# EAGLE design B115X (EAGLE 6.6.0)
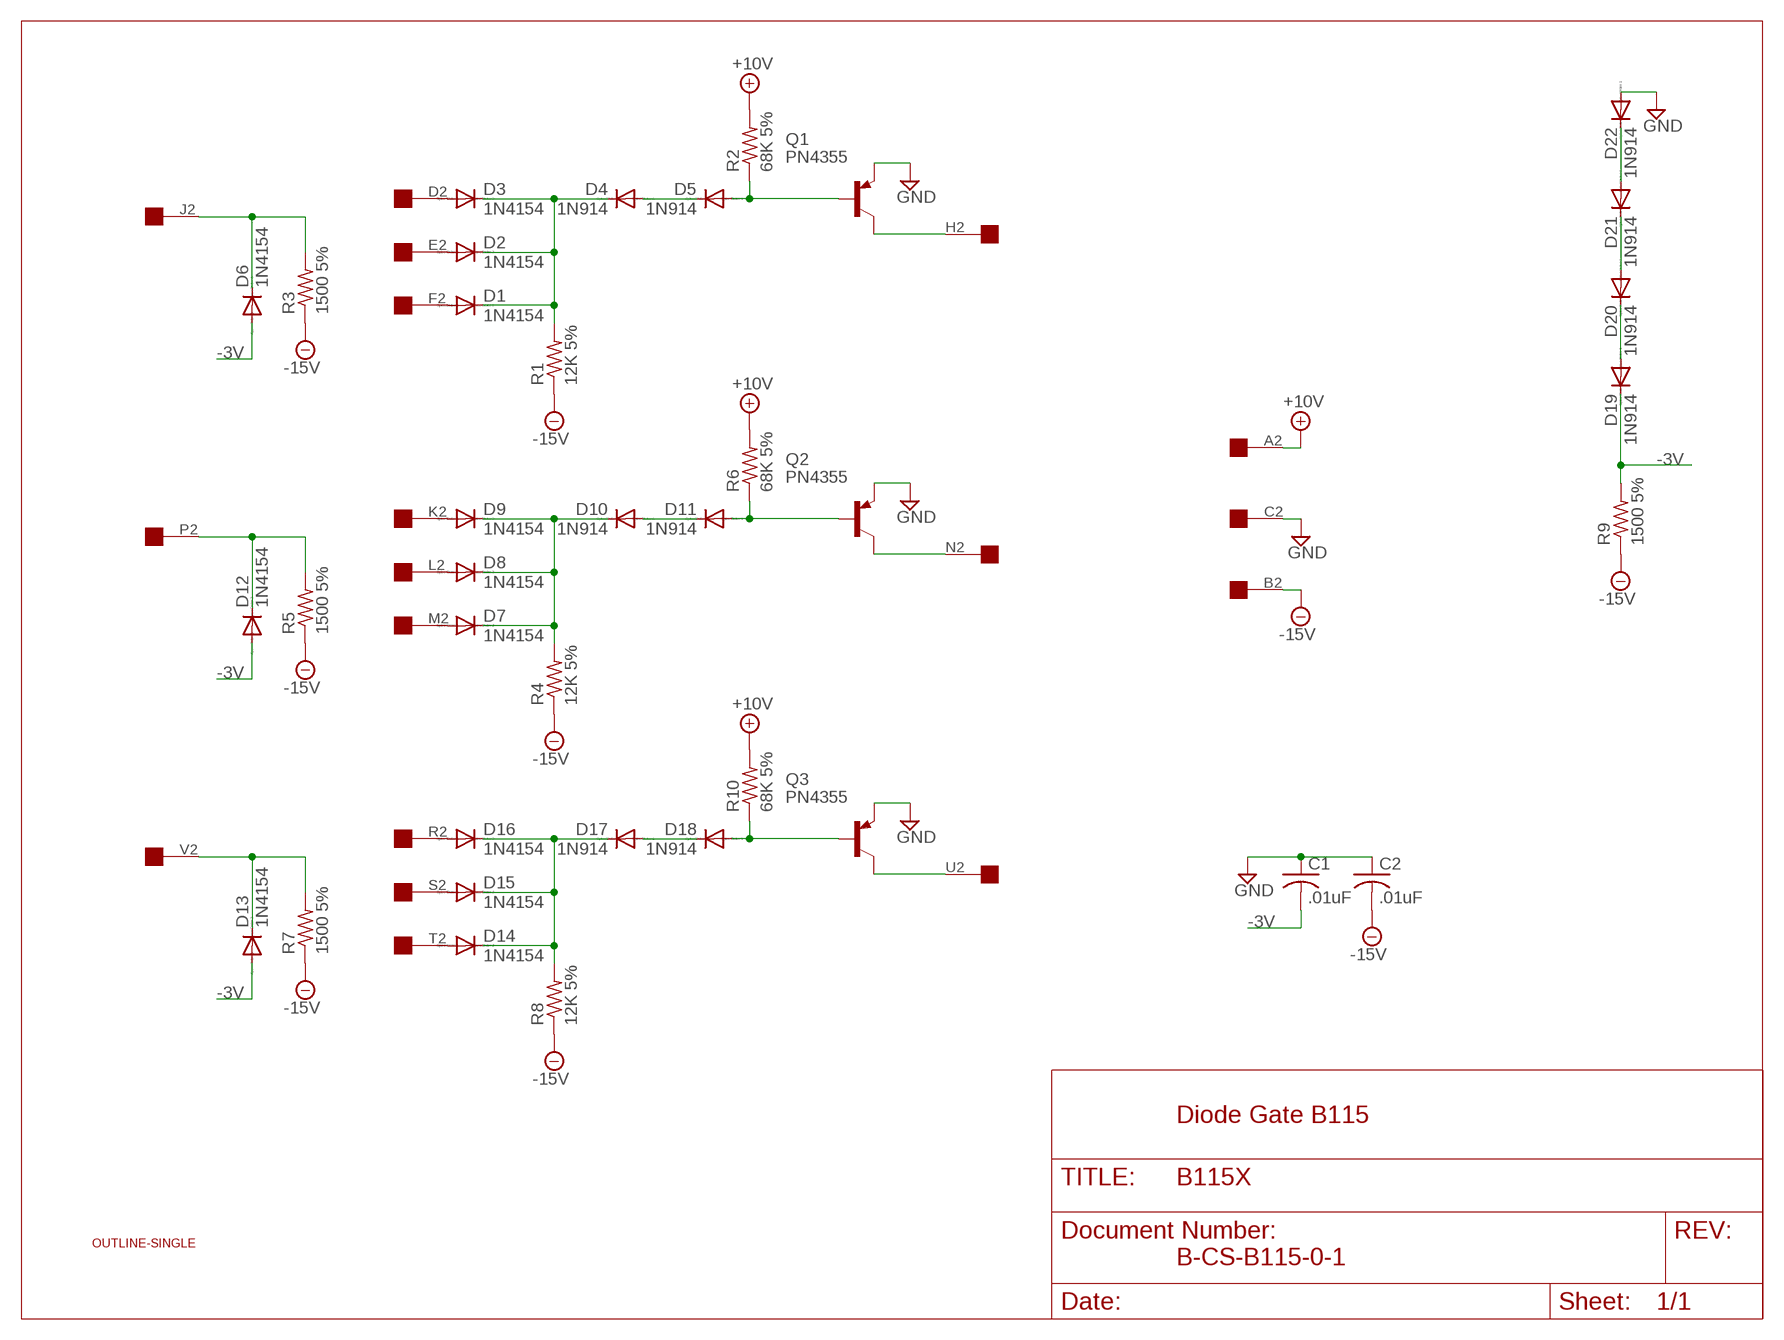
[diagram p0: schematic, sheet 1]

## Parts
C1  .01uF  C-US050-025X075  [C050-025X075]
C2  .01uF  C-US050-025X075  [C050-025X075]
D1  1N4154  1N4148DO35-10  [DO35-10]
D2  1N4154  1N4148DO35-10  [DO35-10]
D3  1N4154  1N4148DO35-10  [DO35-10]
D4  1N914  1N4148DO35-10  [DO35-10]
D5  1N914  1N4148DO35-10  [DO35-10]
D6  1N4154  1N4148DO35-10  [DO35-10]
D7  1N4154  1N4148DO35-10  [DO35-10]
D8  1N4154  1N4148DO35-10  [DO35-10]
D9  1N4154  1N4148DO35-10  [DO35-10]
D10  1N914  1N4148DO35-10  [DO35-10]
D11  1N914  1N4148DO35-10  [DO35-10]
D12  1N4154  1N4148DO35-10  [DO35-10]
D13  1N4154  1N4148DO35-10  [DO35-10]
D14  1N4154  1N4148DO35-10  [DO35-10]
D15  1N4154  1N4148DO35-10  [DO35-10]
D16  1N4154  1N4148DO35-10  [DO35-10]
D17  1N914  1N4148DO35-10  [DO35-10]
D18  1N914  1N4148DO35-10  [DO35-10]
D19  1N914  1N4148DO35-10  [DO35-10]
D20  1N914  1N4148DO35-10  [DO35-10]
D21  1N914  1N4148DO35-10  [DO35-10]
D22  1N914  1N4148DO35-10  [DO35-10]
Q1  PN4355  2N2904  [TO39]
Q2  PN4355  2N2904  [TO39]
Q3  PN4355  2N2904  [TO39]
R1  12K 5%  R-US_0207/10  [0207/10]
R2  68K 5%  R-US_0207/10  [0207/10]
R3  1500 5%  R-US_0207/10  [0207/10]
R4  12K 5%  R-US_0207/10  [0207/10]
R5  1500 5%  R-US_0207/10  [0207/10]
R6  68K 5%  R-US_0207/10  [0207/10]
R7  1500 5%  R-US_0207/10  [0207/10]
R8  12K 5%  R-US_0207/10  [0207/10]
R9  1500 5%  R-US_0207/10  [0207/10]
R10  68K 5%  R-US_0207/10  [0207/10]
U$1  OUTLINE-SINGLE  [SINGLE]
U$2  EDGE-1  [EDGE-CON1]

## Nets
+10V: R2.2 R6.2 R10.2 U$2.A2
-3V [Supply]: C1.2 D6.A D12.A D13.A D19.C R9.2
-15V: C2.2 R1.1 R3.1 R4.1 R5.1 R7.1 R8.1 R9.1 U$2.B2
GND [Supply]: C1.1 C2.1 D22.A Q1.1(E) Q2.1(E) Q3.1(E) U$2.C2
N$1: D7.C D8.C D9.C D10.C R4.2
N$2: D1.A U$2.F2
N$3: D5.A Q1.2(B) R2.1
N$4: D2.A U$2.E2
N$5: D1.C D2.C D3.C D4.C R1.2
N$6: D9.A U$2.K2
N$7: D8.A U$2.L2
N$8: D7.A U$2.M2
N$9: D10.A D11.C
N$10: D3.A U$2.D2
N$11: Q1.3(C) U$2.H2
N$12: D11.A Q2.2(B) R6.1
N$13: Q2.3(C) U$2.N2
N$14: D14.C D15.C D16.C D17.C R8.2
N$15: D4.A D5.C
N$16: D16.A U$2.R2
N$17: D6.C R3.2 U$2.J2
N$18: D15.A U$2.S2
N$19: D14.A U$2.T2
N$20: D12.C R5.2 U$2.P2
N$21: D17.A D18.C
N$22: D18.A Q3.2(B) R10.1
N$23: Q3.3(C) U$2.U2
N$25: D13.C R7.2 U$2.V2
N$26: D21.A D22.C
N$27: D20.A D21.C
N$29: D19.A D20.C

## Notes on the sheet
- Diode Gate B115
- B-CS-B115-0-1

## Library data of the parts
C1 C2 = rcl:C-US: CAPACITOR, American symbol
D1-D22 = diode:1N4148: DIODE high speed (Philips)
Q1-Q3 = transistor-pnp:2N2904*: PNP Transistror
R1-R10 = rcl:R-US_: RESISTOR, American symbol
U$1 = dec-con:OUTLINE-*: Board outlines for DEC boards.
U$2 = dec-con:EDGE-1: Single-Sided DEC Edge Connector -- (side 2)

## Net classes
1 Supply: width 0.813 mm

## Board
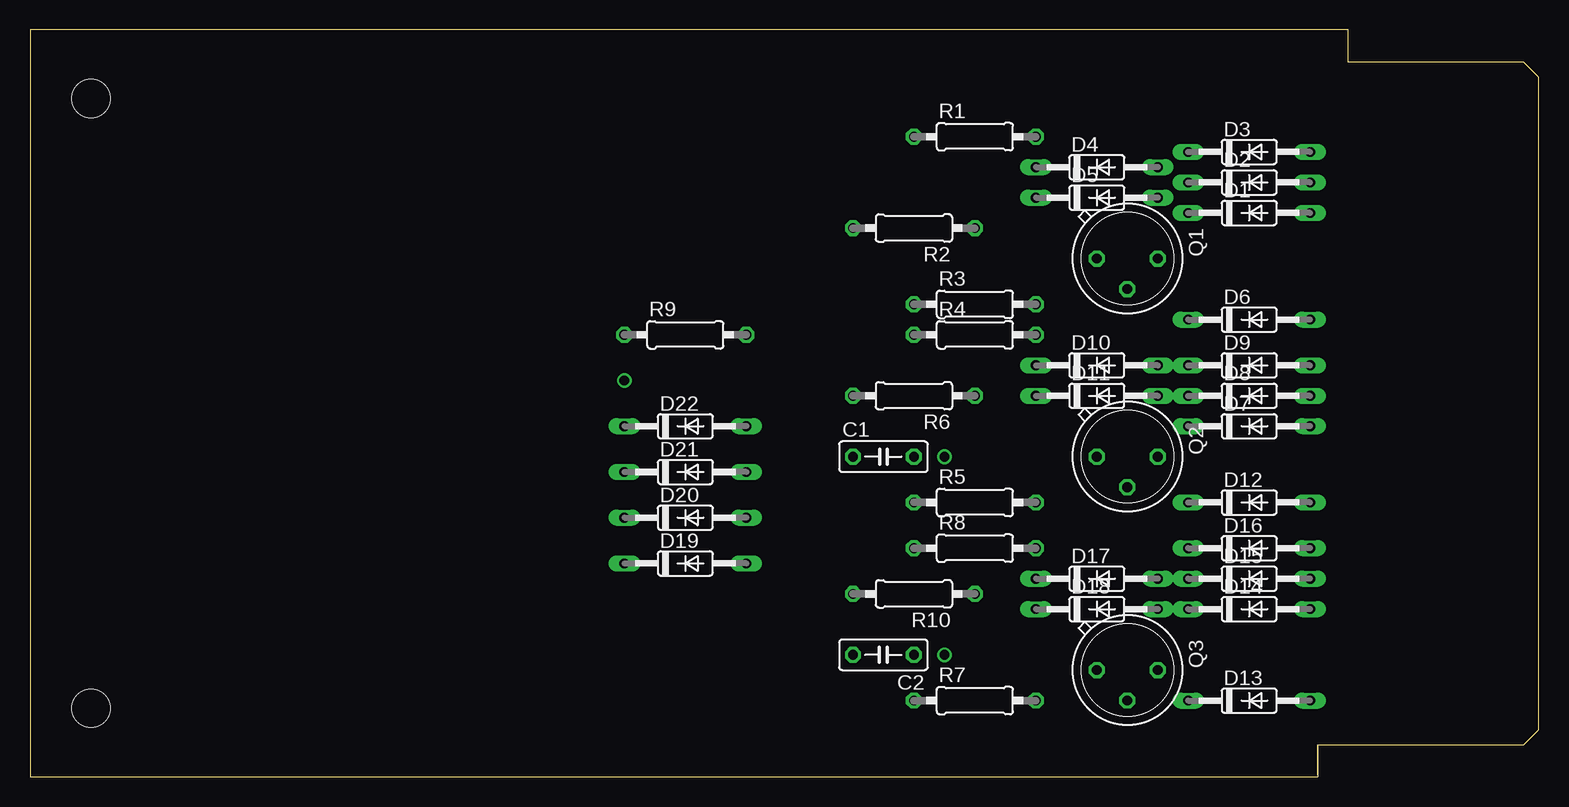
[diagram p1: board, top side]
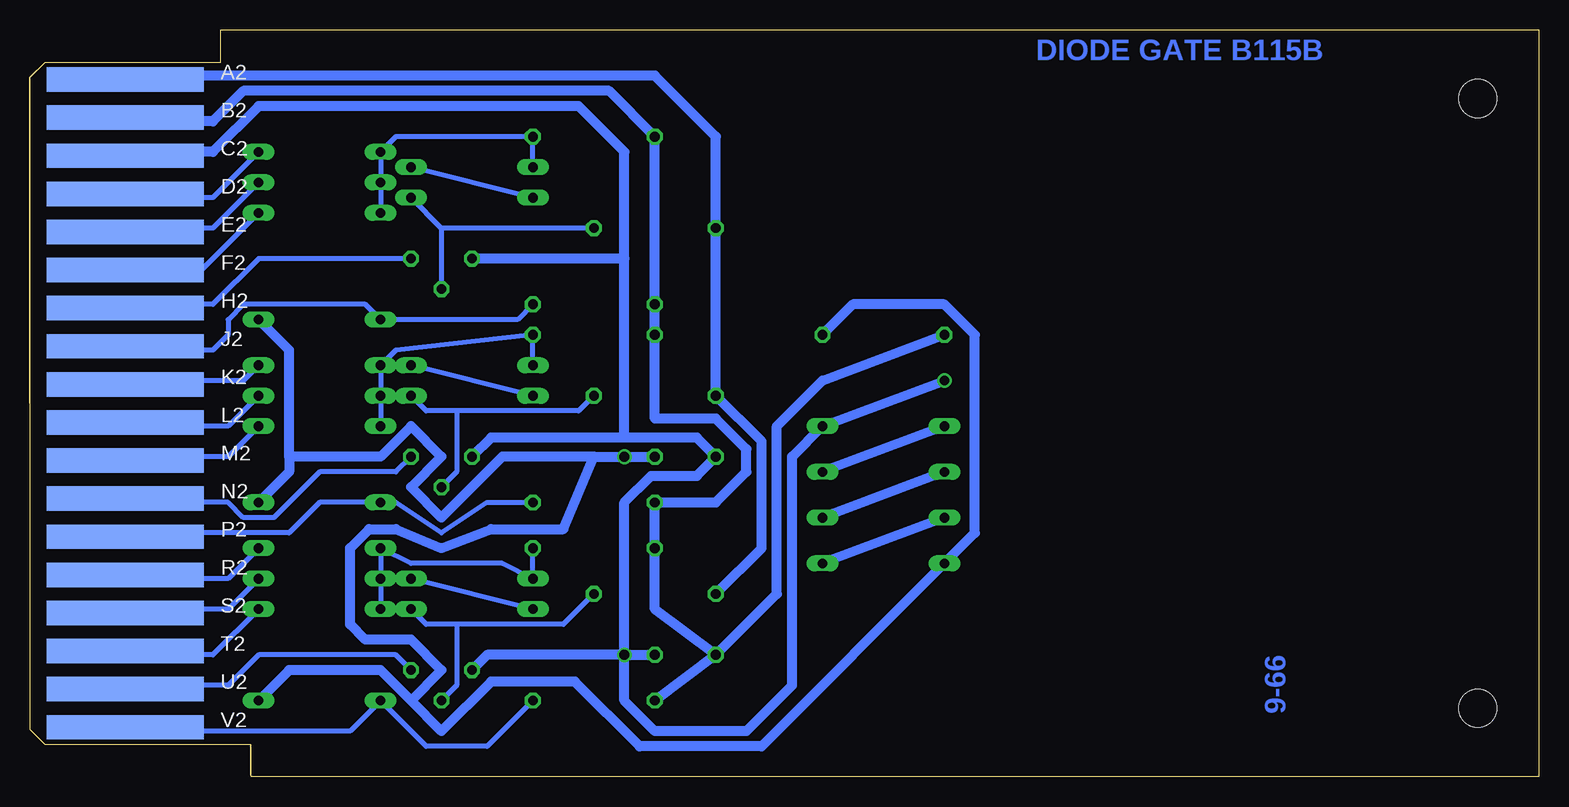
[diagram p2: board, bottom side, seen from below]

Size 125.73 x 62.23 mm. Coordinates in mm from the lower left corner, seen from the top.
Copper layers (1+16): Top 0.035mm / dielectric 1.5mm / Bottom 0.035mm
Design rules "16mils": minimum track width 16mil, minimum drill 32mil, track to track 15mil, track to pad 10mil, pad to pad 10mil, via to via 10mil, smd to smd 10mil, copper to edge 13mil, drill to drill 10mil, minimum pad ring 10mil, minimum via ring 8mil, stop-mask expansion 0mil, vias tented up to drill 0mil, thermal gap 10mil

### Footprints (pad centres in the part's own frame; a part is rotated, then mirrored left to right if it is on the bottom)
C050-025X075 = drill 0.813 octagon: 1 -2.54,0; 2 2.54,0
DO35-10 = drill 0.813 long: A 5.08,0; C -5.08,0
TO39 = drill 0.813 octagon: 1 0,-2.54; 2 2.54,0; 3 0,2.54
0207/10 = drill 0.813 octagon: 1 -5.08,0; 2 5.08,0
SINGLE = hole 3.175: 120.65,56.515; 120.65,5.715
EDGE-CON1 = smd 13.106 x 2.032 bottom: A2 7.938,4.128; B2 7.938,7.303; C2 7.938,10.477; D2 7.938,13.652; E2 7.938,16.828; F2 7.938,20.003; H2 7.938,23.177; J2 7.938,26.352; K2 7.938,29.527; L2 7.938,32.703; M2 7.938,35.877; N2 7.938,39.053; P2 7.938,42.227; R2 7.938,45.403; S2 7.938,48.578; T2 7.938,51.752; U2 7.938,54.928; V2 7.938,58.102

### Placement (x,y rotation side)
C1  71.12,26.67 0 top
C2  71.12,10.16 180 top
D1  101.6,46.99 0 top
D2  101.6,49.53 0 top
D3  101.6,52.07 0 top
D4  88.9,50.8 0 top
D5  88.9,48.26 0 top
D6  101.6,38.1 0 top
D7  101.6,29.21 0 top
D8  101.6,31.75 0 top
D9  101.6,34.29 0 top
D10  88.9,34.29 0 top
D11  88.9,31.75 0 top
D12  101.6,22.86 0 top
D13  101.6,6.35 0 top
D14  101.6,13.97 0 top
D15  101.6,16.51 0 top
D16  101.6,19.05 0 top
D17  88.9,16.51 0 top
D18  88.9,13.97 0 top
D19  54.61,17.78 0 top
D20  54.61,21.59 0 top
D21  54.61,25.4 0 top
D22  54.61,29.21 0 top
Q1  91.44,43.18 270 top
Q2  91.44,26.67 270 top
Q3  91.44,8.89 270 top
R1  78.74,53.34 0 top
R2  73.66,45.72 180 top
R3  78.74,39.37 0 top
R4  78.74,36.83 0 top
R5  78.74,22.86 0 top
R6  73.66,31.75 180 top
R7  78.74,6.35 0 top
R8  78.74,19.05 0 top
R9  54.61,36.83 0 top
R10  73.66,15.24 180 top
U$1  125.73,62.23 180 top
U$2  125.73,62.23 180 top

### Tracks (layer width: path | path; a pad name or v marks a point on that pad's centre or on a via)
+10V
  Bottom 0.813: U$2.A2 117.22,58.04 116.84,58.42 73.66,58.42 68.58,53.34 R2.2 R6.2 64.77,27.94 64.77,19.05 R10.2
-3V  (via drill 0.81)
  Bottom 0.813: D13.A 104.14,8.89 96.52,8.89 93.98,6.35 | 93.98,6.35 91.44,3.81 87.31,7.94 80.33,7.94 74.93,2.54 64.77,2.54 D19.C 46.99,20.32 46.99,36.83 49.53,39.37 57.15,39.37 R9.2 | 93.98,6.35 91.44,8.89 93.98,11.43 97.79,11.43 99.06,12.7 99.06,19.05 97.47,20.64 95.25,20.64 91.44,19.05 87.31,20.64 81.28,20.64 78.74,26.67 | 78.74,26.67 86.36,26.67 91.44,21.59 93.98,24.13 91.44,26.67 93.98,29.21 96.52,26.67 104.14,26.67 | 78.74,26.67 v76.2,26.67 C1.2 | 104.14,26.67 104.14,35.56 D6.A | 104.14,26.67 104.14,25.4 D12.A
-15V
  Bottom 0.813: C2.2 R7.1 | C2.2 73.66,13.97 R8.1 R5.1 68.58,22.86 66.04,25.4 66.04,27.3 68.58,29.84 73.66,29.84 R4.1 R3.1 R1.1 77.47,57.15 107.95,57.15 110.49,54.61 116.84,54.61 U$2.B2 | R9.1 59.69,33.02 63.5,29.21 63.5,15.24 C2.2
GND  (via drill 0.81)
  Bottom 0.813: v76.2,10.16 87.63,10.16 Q3.1 | v76.2,10.16 C2.1 | v76.2,10.16 76.2,22.86 73.98,25.08 70.17,25.08 C1.1 70.17,28.26 75.56,28.26 | 75.56,28.26 76.2,28.26 76.2,43.18 | 75.56,28.26 87.31,28.26 Q2.1 | U$2.C2 116.84,52.07 110.49,52.07 106.68,55.88 80.01,55.88 76.2,52.07 76.2,43.18 | 76.2,43.18 Q1.1 | v49.53,33.02 D22.A 62.23,26.67 62.23,7.62 66.04,3.81 73.66,3.81 76.2,6.35 v76.2,10.16
N$1
  Bottom 0.406: D10.C R4.2 95.25,35.56 D9.C D8.C D7.C
N$2
  Bottom 0.406: U$2.F2 117.12,42.19 116.84,41.91 111.76,41.91 D1.A
N$3
  Bottom 0.406: R2.1 91.44,45.72 | 91.44,45.72 D5.A | 91.44,45.72 Q1.2
N$4
  Bottom 0.406: U$2.E2 117.17,45.39 116.84,45.72 110.49,45.72 D2.A
N$5
  Bottom 0.406: D4.C R1.2 95.25,53.34 D3.C D2.C D1.C
N$6
  Bottom 0.406: U$2.K2 117.14,32.72 116.84,33.02 107.95,33.02 D9.A
N$7
  Bottom 0.406: U$2.L2 117.17,29.54 116.84,29.21 109.22,29.21 D8.A
N$8
  Bottom 0.406: U$2.M2 117.17,26.34 116.84,26.67 109.22,26.67 D7.A
N$9
  Bottom 0.406: D11.C D10.A
N$10
  Bottom 0.406: U$2.D2 117.14,48.56 116.84,48.26 110.49,48.26 D3.A
N$11
  Bottom 0.406: U$2.H2 117.17,39.04 116.84,39.37 110.49,39.37 106.68,43.18 Q1.3
N$12
  Bottom 0.406: R6.1 80.01,30.48 90.17,30.48 | 90.17,30.48 92.71,30.48 D11.A | 90.17,30.48 90.17,25.4 Q2.2
N$13
  Bottom 0.406: U$2.N2 117.17,23.19 116.84,22.86 109.22,22.86 107.95,21.59 105.41,21.59 101.6,25.4 95.25,25.4 Q2.3
N$14
  Bottom 0.406: D17.C R8.2 D17.C | D14.C D15.C D16.C 93.98,17.78 86.36,17.78 D17.C
N$15
  Bottom 0.406: D5.C D4.A
N$16
  Bottom 0.406: U$2.R2 117.17,16.84 116.84,16.51 109.22,16.51 D16.A
N$17
  Bottom 0.406: U$2.J2 117.17,35.89 116.84,35.56 110.49,35.56 109.22,36.83 109.22,38.1 107.95,39.37 97.79,39.37 D6.C 85.09,38.1 R3.2
N$18
  Bottom 0.406: U$2.S2 117.14,13.66 116.84,13.97 109.22,13.97 D15.A
N$19
  Bottom 0.406: U$2.T2 116.84,10.49 116.84,10.16 110.49,10.16 D14.A
N$20
  Bottom 0.406: U$2.P2 117.17,19.99 116.84,20.32 104.14,20.32 101.6,22.86 D12.C 95.25,22.86 91.44,20.32 87.63,22.86 R5.2
N$21
  Bottom 0.406: D18.C D17.A
N$22
  Bottom 0.406: R10.1 81.28,12.7 90.17,12.7 | 90.17,12.7 92.71,12.7 D18.A | 90.17,12.7 90.17,7.62 Q3.2
N$23
  Bottom 0.406: U$2.U2 117.2,7.26 116.84,7.62 109.22,7.62 106.68,10.16 95.25,10.16 Q3.3
N$25
  Bottom 0.406: U$2.V2 117.16,4.13 116.84,3.81 99.06,3.81 D13.C 92.71,2.54 87.63,2.54 R7.2
N$26
  Bottom 0.813: D22.C D21.A
N$27
  Bottom 0.813: D21.C D20.A
N$29
  Bottom 0.813: D20.C D19.A

### Text on the board
Bottom: DIODE GATE B115B | 9-66